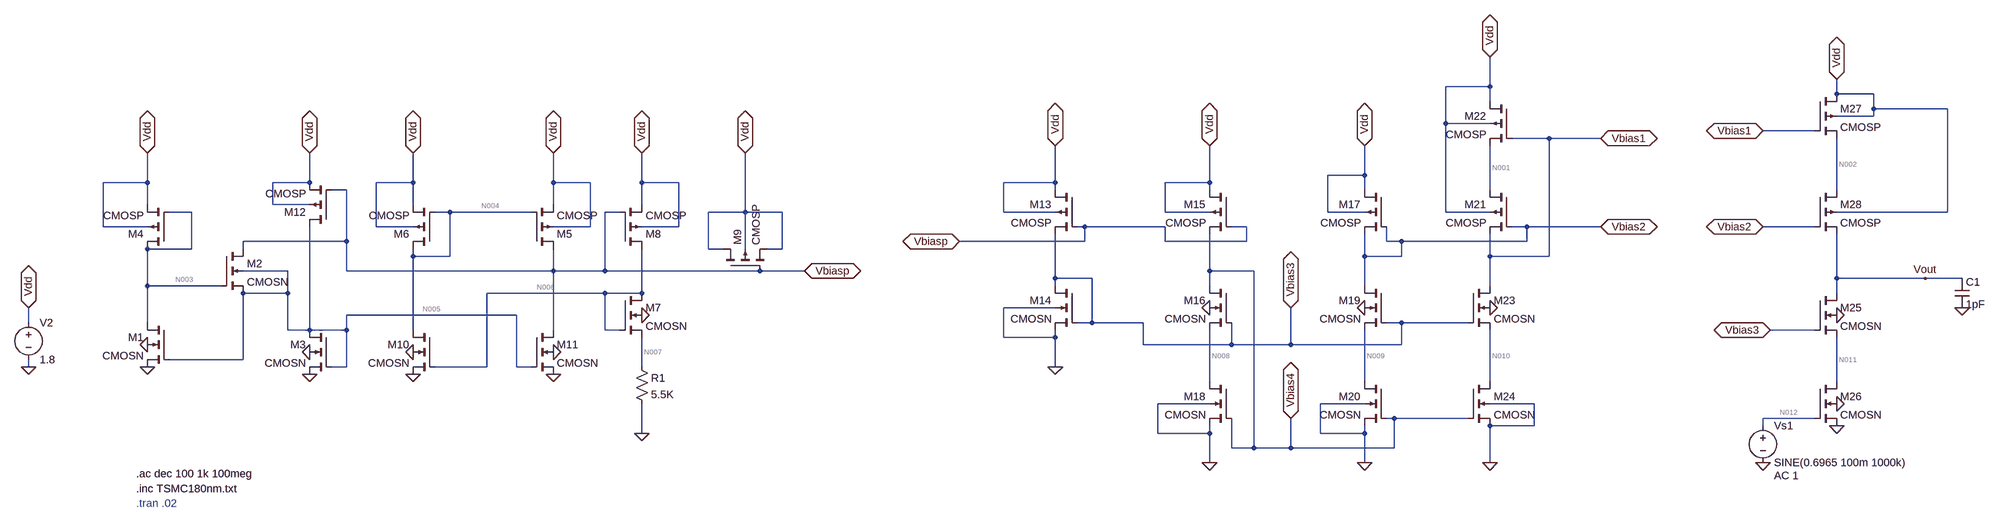
[diagram p0: schematic Schematic_180n.asc]
Schematic_180n.asc, the LTspice schematic file:
Version 4
SHEET 1 5464 1620
WIRE 2352 -160 2352 -224
WIRE 2352 -160 2256 -160
WIRE 3360 -144 3360 -176
WIRE 3440 -144 3360 -144
WIRE 2352 -128 2352 -160
WIRE 3440 -112 3440 -144
WIRE 3600 -112 3440 -112
WIRE 3440 -96 3440 -112
WIRE 3440 -96 3360 -96
WIRE 2256 -80 2256 -160
WIRE 2352 -80 2256 -80
WIRE 3312 -64 3200 -64
WIRE 2480 -48 2400 -48
WIRE 2592 -48 2480 -48
WIRE 2080 32 2080 -32
WIRE 2080 32 2000 32
WIRE -560 48 -560 -16
WIRE -560 48 -656 48
WIRE -208 48 -208 -16
WIRE -208 48 -288 48
WIRE 16 48 16 -16
WIRE 16 48 -64 48
WIRE 320 48 320 -16
WIRE 400 48 320 48
WIRE 512 48 512 -16
WIRE 592 48 512 48
WIRE 1408 48 1408 -32
WIRE 1408 48 1296 48
WIRE 1744 48 1744 -32
WIRE 1744 48 1648 48
WIRE -128 64 -160 64
WIRE 1408 64 1408 48
WIRE 1744 64 1744 48
WIRE 2080 64 2080 32
WIRE 2352 64 2352 -32
WIRE 3360 64 3360 -48
WIRE -560 96 -560 48
WIRE -288 96 -288 48
WIRE -208 96 -288 96
WIRE 16 96 16 48
WIRE 320 96 320 48
WIRE 512 96 512 48
WIRE -464 112 -512 112
WIRE 96 112 64 112
WIRE 272 112 96 112
WIRE 464 112 432 112
WIRE 736 112 736 -16
WIRE 736 112 656 112
WIRE 816 112 736 112
WIRE 1296 112 1296 48
WIRE 1408 112 1296 112
WIRE 1648 112 1648 48
WIRE 1744 112 1648 112
WIRE 2000 112 2000 32
WIRE 2080 112 2000 112
WIRE 2256 112 2256 -80
WIRE 2352 112 2256 112
WIRE 3600 112 3600 -112
WIRE 3600 112 3360 112
WIRE -656 144 -656 48
WIRE -560 144 -656 144
WIRE -64 144 -64 48
WIRE 16 144 -64 144
WIRE 400 144 400 48
WIRE 400 144 320 144
WIRE 592 144 592 48
WIRE 592 144 512 144
WIRE 1472 144 1456 144
WIRE 1648 144 1472 144
WIRE 1824 144 1792 144
WIRE 2432 144 2400 144
WIRE 2592 144 2432 144
WIRE 3312 144 3200 144
WIRE -128 176 -128 64
WIRE -128 176 -352 176
WIRE 1472 176 1472 144
WIRE 1472 176 1200 176
WIRE 1648 176 1648 144
WIRE 1824 176 1824 144
WIRE 1824 176 1648 176
WIRE 2128 176 2128 144
WIRE 2160 176 2128 176
WIRE 2432 176 2432 144
WIRE 2432 176 2160 176
WIRE -560 192 -560 176
WIRE -464 192 -464 112
WIRE -464 192 -560 192
WIRE -352 192 -352 176
WIRE 656 192 656 112
WIRE 688 192 656 192
WIRE 736 192 736 112
WIRE 816 192 816 112
WIRE 816 192 784 192
WIRE 16 208 16 192
WIRE 96 208 96 112
WIRE 96 208 16 208
WIRE 2080 208 2080 160
WIRE 2160 208 2160 176
WIRE 2160 208 2080 208
WIRE 2352 208 2352 160
WIRE 2480 208 2480 -48
WIRE 2480 208 2352 208
WIRE -256 240 -352 240
WIRE -128 240 -128 176
WIRE 320 240 320 192
WIRE 320 240 -128 240
WIRE 432 240 432 112
WIRE 432 240 320 240
WIRE 768 240 432 240
WIRE 864 240 768 240
WIRE 1744 240 1744 160
WIRE 1840 240 1744 240
WIRE 1408 256 1408 160
WIRE 1488 256 1408 256
WIRE 3360 256 3360 160
WIRE 3552 256 3360 256
WIRE 3632 256 3552 256
WIRE -560 272 -560 192
WIRE -400 272 -560 272
WIRE 1408 272 1408 256
WIRE 1744 272 1744 240
WIRE 2080 272 2080 208
WIRE 2352 272 2352 208
WIRE -256 288 -256 240
WIRE -256 288 -352 288
WIRE 432 288 176 288
WIRE 512 288 512 192
WIRE 512 288 432 288
WIRE 3360 288 3360 256
WIRE 1408 320 1296 320
WIRE 240 336 -128 336
WIRE -944 352 -944 320
WIRE -560 352 -560 272
WIRE 1488 352 1488 256
WIRE 1488 352 1456 352
WIRE 1600 352 1488 352
WIRE 2160 352 2128 352
WIRE 2304 352 2160 352
WIRE -256 368 -256 288
WIRE -208 368 -208 144
WIRE -208 368 -256 368
WIRE -128 368 -128 336
WIRE -128 368 -208 368
WIRE 16 368 16 208
WIRE 320 368 320 240
WIRE 432 368 432 288
WIRE 464 368 432 368
WIRE 3312 368 3216 368
WIRE -208 384 -208 368
WIRE 1296 384 1296 320
WIRE 1408 384 1408 368
WIRE 1408 384 1296 384
WIRE 1600 400 1600 352
WIRE 1792 400 1792 352
WIRE 1792 400 1600 400
WIRE 1920 400 1920 320
WIRE 1920 400 1792 400
WIRE 2160 400 2160 352
WIRE 2160 400 1920 400
WIRE -352 432 -352 288
WIRE -352 432 -512 432
WIRE -944 448 -944 432
WIRE -128 448 -128 368
WIRE -128 448 -160 448
WIRE 176 448 176 288
WIRE 176 448 64 448
WIRE 240 448 240 336
WIRE 272 448 240 448
WIRE 512 448 512 384
WIRE 1408 448 1408 384
WIRE 1744 480 1744 368
WIRE 2080 480 2080 368
WIRE 2352 480 2352 368
WIRE 3360 480 3360 384
WIRE 1744 528 1632 528
WIRE 2080 528 1984 528
WIRE 2448 528 2352 528
WIRE 2144 560 2128 560
WIRE 2304 560 2144 560
WIRE 3312 560 3200 560
WIRE 2448 576 2448 528
WIRE 2448 576 2352 576
WIRE 3200 576 3200 560
WIRE 512 592 512 528
WIRE 1632 592 1632 528
WIRE 1744 592 1744 576
WIRE 1744 592 1632 592
WIRE 1984 592 1984 528
WIRE 2080 592 2080 576
WIRE 2080 592 1984 592
WIRE 1792 624 1792 560
WIRE 1840 624 1840 240
WIRE 1840 624 1792 624
WIRE 1920 624 1920 560
WIRE 1920 624 1840 624
WIRE 2144 624 2144 560
WIRE 2144 624 1920 624
WIRE 1744 656 1744 592
WIRE 2080 656 2080 592
WIRE 2352 656 2352 576
FLAG -560 448 0
FLAG -208 464 0
FLAG 16 464 0
FLAG 320 464 0
FLAG 512 592 0
FLAG 512 336 0
FLAG 864 240 Vbiasp
IOPIN 864 240 BiDir
FLAG -560 400 0
FLAG -208 416 0
FLAG 16 416 0
FLAG 320 416 0
FLAG -944 448 0
FLAG -944 320 Vdd
IOPIN -944 320 BiDir
FLAG 16 -16 Vdd
IOPIN 16 -16 BiDir
FLAG -208 -16 Vdd
IOPIN -208 -16 BiDir
FLAG -560 -16 Vdd
IOPIN -560 -16 BiDir
FLAG 320 -16 Vdd
IOPIN 320 -16 BiDir
FLAG 512 -16 Vdd
IOPIN 512 -16 BiDir
FLAG 736 -16 Vdd
IOPIN 736 -16 BiDir
FLAG 1744 656 0
FLAG 2080 656 0
FLAG 2352 656 0
FLAG 1408 448 0
FLAG 1408 -32 Vdd
IOPIN 1408 -32 BiDir
FLAG 1744 -32 Vdd
IOPIN 1744 -32 BiDir
FLAG 2080 -32 Vdd
IOPIN 2080 -32 BiDir
FLAG 2352 -224 Vdd
IOPIN 2352 -224 BiDir
FLAG 2592 -48 Vbias1
IOPIN 2592 -48 BiDir
FLAG 2592 144 Vbias2
IOPIN 2592 144 BiDir
FLAG 1920 320 Vbias3
IOPIN 1920 320 BiDir
FLAG 1920 560 Vbias4
IOPIN 1920 560 BiDir
FLAG 1744 320 0
FLAG 2080 320 0
FLAG 2352 320 0
FLAG 1200 176 Vbiasp
IOPIN 1200 176 BiDir
FLAG 3360 576 0
FLAG 3200 656 0
FLAG 3632 320 0
FLAG 3552 256 Vout
FLAG 3360 336 0
FLAG 3360 528 0
FLAG 3360 -176 Vdd
IOPIN 3360 -176 BiDir
FLAG 3200 -64 Vbias1
IOPIN 3200 -64 BiDir
FLAG 3200 144 Vbias2
IOPIN 3200 144 BiDir
FLAG 3216 368 Vbias3
IOPIN 3216 368 BiDir
SYMBOL nmos4 -512 352 M0
SYMATTR InstName M1
SYMATTR Value2 l=360n w=1800n
SYMATTR Value CMOSN
SYMBOL nmos4 -400 192 R0
SYMATTR InstName M2
SYMATTR Value2 l=360n w=720n
SYMATTR Value CMOSN
SYMBOL nmos4 -160 368 M0
SYMATTR InstName M3
SYMATTR Value2 l=360n w=1800n
SYMATTR Value CMOSN
SYMBOL pmos4 -512 192 R180
SYMATTR InstName M4
SYMATTR Value2 l=3600n w=1800n
SYMATTR Value CMOSP
SYMBOL pmos4 272 192 M180
SYMATTR InstName M5
SYMATTR Value2 l=360n w=4320n
SYMATTR Value CMOSP
SYMBOL pmos4 64 192 R180
SYMATTR InstName M6
SYMATTR Value2 l=360n w=4320n
SYMATTR Value CMOSP
SYMBOL nmos4 464 288 R0
SYMATTR InstName M7
SYMATTR Value2 l=360n w=5400n
SYMATTR Value CMOSN
SYMBOL res 496 432 R0
SYMATTR InstName R1
SYMATTR Value 5.5K
SYMBOL pmos4 464 192 M180
SYMATTR InstName M8
SYMATTR Value2 l=360n w=4320n
SYMATTR Value CMOSP
SYMBOL pmos4 688 240 R270
SYMATTR InstName M9
SYMATTR Value2 l=9000n w=9000n
SYMATTR Value CMOSP
SYMBOL nmos4 64 368 M0
SYMATTR InstName M10
SYMATTR Value CMOSN
SYMATTR Value2 l=360n w=1800n
SYMBOL nmos4 272 368 R0
SYMATTR InstName M11
SYMATTR Value CMOSN
SYMATTR Value2 l=360n w=1800n
SYMBOL pmos4 -160 144 R180
SYMATTR InstName M12
SYMATTR Value CMOSP
SYMATTR Value2 l=360n w=4320n
SYMBOL voltage -944 336 R0
WINDOW 123 0 0 Left 0
WINDOW 39 0 0 Left 0
SYMATTR InstName V2
SYMATTR Value 1.8
SYMBOL pmos4 1456 64 M0
SYMATTR InstName M13
SYMATTR Value CMOSP
SYMATTR Value2 l=360n w=4320n
SYMBOL nmos4 1456 272 M0
SYMATTR InstName M14
SYMATTR Value CMOSN
SYMATTR Value2 l=1206n w=360n
SYMBOL pmos4 1792 64 M0
SYMATTR InstName M15
SYMATTR Value CMOSP
SYMATTR Value2 l=360n w=4320n
SYMBOL nmos4 1792 272 M0
SYMATTR InstName M16
SYMATTR Value CMOSN
SYMATTR Value2 l=360n w=1800n
SYMBOL pmos4 2128 64 M0
SYMATTR InstName M17
SYMATTR Value CMOSP
SYMATTR Value2 l=900n w=1190n
SYMBOL nmos4 1792 480 M0
SYMATTR InstName M18
SYMATTR Value CMOSN
SYMATTR Value2 l=360n w=1800n
SYMBOL nmos4 2128 272 M0
SYMATTR InstName M19
SYMATTR Value CMOSN
SYMATTR Value2 l=360n w=1980n
SYMBOL nmos4 2128 480 M0
SYMATTR InstName M20
SYMATTR Value CMOSN
SYMATTR Value2 l=360n w=1800n
SYMBOL pmos4 2400 64 M0
SYMATTR InstName M21
SYMATTR Value CMOSP
SYMATTR Value2 l=360n w=3250n
SYMBOL pmos4 2400 -128 M0
SYMATTR InstName M22
SYMATTR Value CMOSP
SYMATTR Value2 l=360n w=1710n
SYMBOL nmos4 2304 272 R0
SYMATTR InstName M23
SYMATTR Value CMOSN
SYMATTR Value2 l=360n w=1800n
SYMBOL nmos4 2304 480 R0
SYMATTR InstName M24
SYMATTR Value CMOSN
SYMATTR Value2 l=360n w=1800n
SYMBOL voltage 3200 560 R0
WINDOW 123 24 124 Left 2
WINDOW 39 0 0 Left 0
SYMATTR Value2 AC 1
SYMATTR InstName Vs1
SYMATTR Value SINE(0.6965 100m 1000k)
SYMBOL cap 3616 256 R0
SYMATTR InstName C1
SYMATTR Value 1pF
SYMBOL nmos4 3312 288 R0
SYMATTR InstName M25
SYMATTR Value CMOSN
SYMATTR Value2 l=180n w=900n
SYMBOL nmos4 3312 480 R0
SYMATTR InstName M26
SYMATTR Value CMOSN
SYMATTR Value2 l=180n w=900n
SYMBOL pmos4 3312 -144 R0
SYMATTR InstName M27
SYMATTR Value CMOSP
SYMATTR Value2 l=180n w=4356n
SYMBOL pmos4 3312 64 R0
SYMATTR InstName M28
SYMATTR Value CMOSP
SYMATTR Value2 l=180n w=4356n
TEXT -584 712 Left 2 !.inc TSMC180nm.txt
TEXT -584 744 Left 2 ;.tran .02
TEXT -584 680 Left 2 !.ac dec 100 1k 100meg

The netlist it stands for:
* Schematic_180n.asc
M1 N003 N005 0 0 CMOSN l=360n w=1800n
M2 Vbiasp N003 N005 N005 CMOSN l=360n w=720n
M3 N005 N005 0 0 CMOSN l=360n w=1800n
M4 N003 N003 Vdd Vdd CMOSP l=3600n w=1800n
M5 Vbiasp N004 Vdd Vdd CMOSP l=360n w=4320n
M6 N004 N004 Vdd Vdd CMOSP l=360n w=4320n
M7 N006 N006 N007 0 CMOSN l=360n w=5400n
R1 N007 0 5.5K
M8 N006 Vbiasp Vdd Vdd CMOSP l=360n w=4320n
M9 Vdd Vbiasp Vdd Vdd CMOSP l=9000n w=9000n
M10 N004 N006 0 0 CMOSN l=360n w=1800n
M11 Vbiasp N005 0 0 CMOSN l=360n w=1800n
M12 N005 Vbiasp Vdd Vdd CMOSP l=360n w=4320n
V2 Vdd 0 1.8
M13 Vdd Vbiasp Vbias3 Vdd CMOSP l=360n w=4320n
M14 Vbias3 Vbias3 0 0 CMOSN l=1206n w=360n
M15 Vdd Vbiasp Vbias4 Vdd CMOSP l=360n w=4320n
M16 Vbias4 Vbias3 N008 0 CMOSN l=360n w=1800n
M17 Vdd Vbias2 Vbias2 Vdd CMOSP l=900n w=1190n
M18 N008 Vbias4 0 0 CMOSN l=360n w=1800n
M19 Vbias2 Vbias3 N009 0 CMOSN l=360n w=1980n
M20 N009 Vbias4 0 0 CMOSN l=360n w=1800n
M21 N001 Vbias2 Vbias1 Vdd CMOSP l=360n w=3250n
M22 Vdd Vbias1 N001 Vdd CMOSP l=360n w=1710n
M23 Vbias1 Vbias3 N010 0 CMOSN l=360n w=1800n
M24 N010 Vbias4 0 0 CMOSN l=360n w=1800n
Vs1 N012 0 SINE(0.6965 100m 1000k) AC 1
C1 Vout 0 1pF
M25 Vout Vbias3 N011 0 CMOSN l=180n w=900n
M26 N011 N012 0 0 CMOSN l=180n w=900n
M27 Vdd Vbias1 N002 Vdd CMOSP l=180n w=4356n
M28 N002 Vbias2 Vout Vdd CMOSP l=180n w=4356n
.model NMOS NMOS
.model PMOS PMOS
.lib standard.mos
.inc TSMC180nm.txt
* .tran .02
.ac dec 100 1k 100meg
.backanno
.end

* Results of the author's LTspice run, read from the files saved beside the schematic
* Operating Point, zero values left out:
*   V(n003) = 583.5 mV
*   V(n005) = 559.5 mV
*   V(vbiasp) = 1.223 V
*   V(vdd) = 1.8 V
*   V(n004) = 1.209 V
*   V(n006) = 559.8 mV
*   V(n007) = 44.12 mV
*   V(vbias3) = 864.9 mV
*   V(vbias4) = 564.6 mV
*   V(n008) = 239.2 mV
*   V(vbias2) = 911 mV
*   V(n009) = 246.9 mV
*   V(n001) = 1.581 V
*   V(vbias1) = 1.121 V
*   V(n010) = 244.5 mV
*   V(n012) = 696.5 mV
*   V(vout) = 341.8 mV
*   V(n011) = 145.2 mV
*   V(n002) = 1.615 V
*   Id(M1) = 8.059 µA
*   Is(M1) = -8.059 µA
*   Id(M2) = 7.039 pA
*   Is(M2) = -6.366 pA
*   Id(M3) = 8.023 µA
*   Is(M3) = -8.023 µA
*   Id(M7) = 8.022 µA
*   Is(M7) = -8.022 µA
*   Id(M10) = 8.956 µA
*   Ib(M10) = -1.219 pA
*   Is(M10) = -8.956 µA
*   Id(M11) = 8.937 µA
*   Ib(M11) = -1.233 pA
*   Is(M11) = -8.937 µA
*   Id(M14) = 7.757 µA
*   Is(M14) = -7.757 µA
*   Id(M16) = 8.018 µA
*   Is(M16) = -8.018 µA
*   Id(M18) = 8.018 µA
*   Is(M18) = -8.018 µA
*   Id(M19) = 8.044 µA
*   Ib(M19) = -1.178 pA
*   Is(M19) = -8.044 µA
*   Id(M20) = 8.044 µA
*   Is(M20) = -8.044 µA
*   Id(M23) = 8.036 µA
*   Ib(M23) = -1.385 pA
*   Is(M23) = -8.036 µA
*   Id(M24) = 8.036 µA
*   Is(M24) = -8.036 µA
*   Id(M25) = 31.32 µA
*   Is(M25) = -31.32 µA
*   Id(M26) = 31.32 µA
*   Is(M26) = -31.32 µA
*   Id(M4) = -8.059 µA
*   Ib(M4) = 1.226 pA
*   Is(M4) = 8.059 µA
*   Id(M5) = -8.937 µA
*   Is(M5) = 8.937 µA
*   Id(M6) = -8.956 µA
*   Is(M6) = 8.956 µA
*   Id(M8) = -8.022 µA
*   Ib(M8) = 1.25 pA
*   Is(M8) = 8.022 µA
*   Id(M12) = -8.023 µA
*   Ib(M12) = 1.25 pA
*   Is(M12) = 8.023 µA
*   Id(M13) = 7.757 µA
*   Is(M13) = -7.757 µA
*   Id(M15) = 8.018 µA
*   Ib(M15) = 1.245 pA
*   Is(M15) = -8.018 µA
*   Id(M17) = 8.044 µA
*   Is(M17) = -8.044 µA
*   Id(M21) = 8.036 µA
*   Is(M21) = -8.036 µA
*   Id(M22) = 8.036 µA
*   Is(M22) = -8.036 µA
*   Id(M27) = 31.32 µA
*   Is(M27) = -31.32 µA
*   Id(M28) = 31.32 µA
*   Ib(M28) = 1.663 pA
*   Is(M28) = -31.32 µA
*   I(R1) = 8.022 µA
*   I(V2) = -105.2 µA
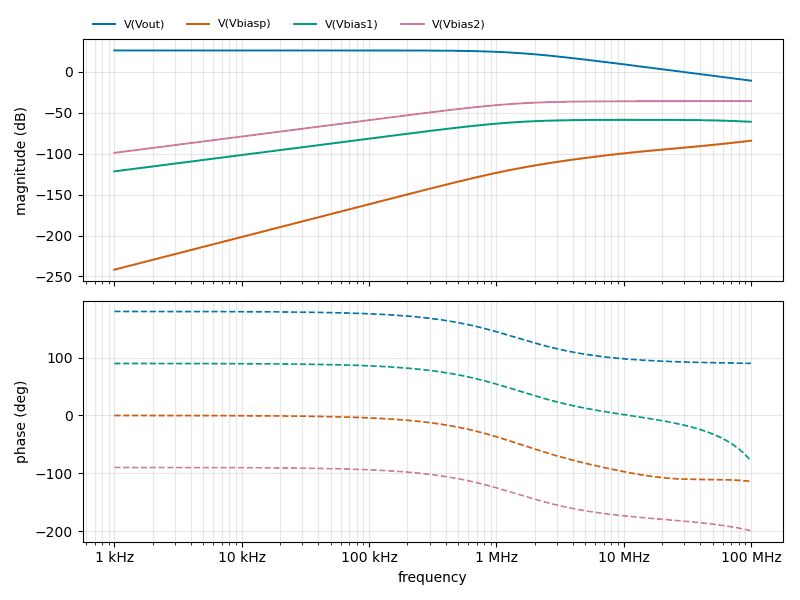
[diagram p1: AC Analysis of Schematic_180n.asc, plotted from the saved traces]
* AC Analysis, 1 run:
*   V(Vout): 26.04 dB at 1 kHz, -10.91 dB at 100 MHz, peak 26.04 dB at 1 kHz, 3 dB below the peak at 1.426 MHz
*   V(Vbiasp): -241.74 dB at 1 kHz, -84.30 dB at 100 MHz, peak -84.30 dB at 100 MHz, 3 dB below the peak at 67.02 MHz
*   V(Vbias1): -121.66 dB at 1 kHz, -61.13 dB at 100 MHz, peak -58.72 dB at 11.75 MHz, 3 dB below the peak at 1.383 MHz
*   V(Vbias2): -99.07 dB at 1 kHz, -35.83 dB at 100 MHz, peak -35.83 dB at 100 MHz, 3 dB below the peak at 1.479 MHz